# Altium project Main_Matrix_Schematics.PrjPcb
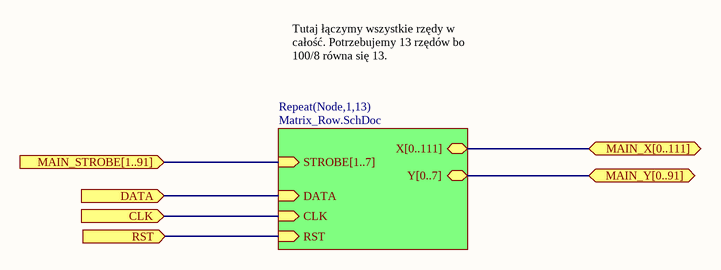
[diagram p0: Main_Schematic.SchDoc]
3 sheets, 273 parts. Net scope: hierarchical (ports join the sheet entries above them; power ports are global).
Sheets:
  Main_Schematic.SchDoc
    Node1 = Matrix_Row.SchDoc
      Node1 = Single_Matrix.SchDoc
      Node2 = Single_Matrix.SchDoc
      Node3 = Single_Matrix.SchDoc
      Node4 = Single_Matrix.SchDoc
      Node5 = Single_Matrix.SchDoc
      Node6 = Single_Matrix.SchDoc
      Node7 = Single_Matrix.SchDoc
    Node2 = Matrix_Row.SchDoc
      Node1 = Single_Matrix.SchDoc
      Node2 = Single_Matrix.SchDoc
      Node3 = Single_Matrix.SchDoc
      Node4 = Single_Matrix.SchDoc
      Node5 = Single_Matrix.SchDoc
      Node6 = Single_Matrix.SchDoc
      Node7 = Single_Matrix.SchDoc
    Node3 = Matrix_Row.SchDoc
      Node1 = Single_Matrix.SchDoc
      Node2 = Single_Matrix.SchDoc
      Node3 = Single_Matrix.SchDoc
      Node4 = Single_Matrix.SchDoc
      Node5 = Single_Matrix.SchDoc
      Node6 = Single_Matrix.SchDoc
      Node7 = Single_Matrix.SchDoc
    Node4 = Matrix_Row.SchDoc
      Node1 = Single_Matrix.SchDoc
      Node2 = Single_Matrix.SchDoc
      Node3 = Single_Matrix.SchDoc
      Node4 = Single_Matrix.SchDoc
      Node5 = Single_Matrix.SchDoc
      Node6 = Single_Matrix.SchDoc
      Node7 = Single_Matrix.SchDoc
    Node5 = Matrix_Row.SchDoc
      Node1 = Single_Matrix.SchDoc
      Node2 = Single_Matrix.SchDoc
      Node3 = Single_Matrix.SchDoc
      Node4 = Single_Matrix.SchDoc
      Node5 = Single_Matrix.SchDoc
      Node6 = Single_Matrix.SchDoc
      Node7 = Single_Matrix.SchDoc
    Node6 = Matrix_Row.SchDoc
      Node1 = Single_Matrix.SchDoc
      Node2 = Single_Matrix.SchDoc
      Node3 = Single_Matrix.SchDoc
      Node4 = Single_Matrix.SchDoc
      Node5 = Single_Matrix.SchDoc
      Node6 = Single_Matrix.SchDoc
      Node7 = Single_Matrix.SchDoc
    Node7 = Matrix_Row.SchDoc
      Node1 = Single_Matrix.SchDoc
      Node2 = Single_Matrix.SchDoc
      Node3 = Single_Matrix.SchDoc
      Node4 = Single_Matrix.SchDoc
      Node5 = Single_Matrix.SchDoc
      Node6 = Single_Matrix.SchDoc
      Node7 = Single_Matrix.SchDoc
    Node8 = Matrix_Row.SchDoc
      Node1 = Single_Matrix.SchDoc
      Node2 = Single_Matrix.SchDoc
      Node3 = Single_Matrix.SchDoc
      Node4 = Single_Matrix.SchDoc
      Node5 = Single_Matrix.SchDoc
      Node6 = Single_Matrix.SchDoc
      Node7 = Single_Matrix.SchDoc
    Node9 = Matrix_Row.SchDoc
      Node1 = Single_Matrix.SchDoc
      Node2 = Single_Matrix.SchDoc
      Node3 = Single_Matrix.SchDoc
      Node4 = Single_Matrix.SchDoc
      Node5 = Single_Matrix.SchDoc
      Node6 = Single_Matrix.SchDoc
      Node7 = Single_Matrix.SchDoc
    Node10 = Matrix_Row.SchDoc
      Node1 = Single_Matrix.SchDoc
      Node2 = Single_Matrix.SchDoc
      Node3 = Single_Matrix.SchDoc
      Node4 = Single_Matrix.SchDoc
      Node5 = Single_Matrix.SchDoc
      Node6 = Single_Matrix.SchDoc
      Node7 = Single_Matrix.SchDoc
    Node11 = Matrix_Row.SchDoc
      Node1 = Single_Matrix.SchDoc
      Node2 = Single_Matrix.SchDoc
      Node3 = Single_Matrix.SchDoc
      Node4 = Single_Matrix.SchDoc
      Node5 = Single_Matrix.SchDoc
      Node6 = Single_Matrix.SchDoc
      Node7 = Single_Matrix.SchDoc
    Node12 = Matrix_Row.SchDoc
      Node1 = Single_Matrix.SchDoc
      Node2 = Single_Matrix.SchDoc
      Node3 = Single_Matrix.SchDoc
      Node4 = Single_Matrix.SchDoc
      Node5 = Single_Matrix.SchDoc
      Node6 = Single_Matrix.SchDoc
      Node7 = Single_Matrix.SchDoc
    Node13 = Matrix_Row.SchDoc
      Node1 = Single_Matrix.SchDoc
      Node2 = Single_Matrix.SchDoc
      Node3 = Single_Matrix.SchDoc
      Node4 = Single_Matrix.SchDoc
      Node5 = Single_Matrix.SchDoc
      Node6 = Single_Matrix.SchDoc
      Node7 = Single_Matrix.SchDoc

## Sheet Main_Schematic.SchDoc
size A4; Date: 1.06.2026; Author: Jan Rutkowski; CompanyName: KN_HARDWIRE; SheetNumber: 1; SheetTotal: 3

### Sub-sheets
Repeat(Node,1,13) = Matrix_Row.SchDoc: CLK (in), DATA (in), RST (in), STROBE[1..7] (in), X[0..111] (bidir), Y[0..7] (bidir)

### Ports
CLK (in), DATA (in), MAIN_STROBE[1..91] (in), MAIN_X[0..111] (bidir), MAIN_Y[0..91] (bidir), RST (in)

### Nets
(unnamed): port DATA, sheet Repeat(Node,1,13)/DATA
(unnamed): port CLK, sheet Repeat(Node,1,13)/CLK
(unnamed): port RST, sheet Repeat(Node,1,13)/RST

### Buses and harness runs
bus port MAIN_STROBE[1..91] = sheet Repeat(Node,1,13)/STROBE[1..7]
bus port MAIN_X[0..111] = sheet Repeat(Node,1,13)/X[0..111]
bus port MAIN_Y[0..91] = sheet Repeat(Node,1,13)/Y[0..7]

### Notes on the sheet
- Tutaj łączymy wszystkie rzędy w całość. Potrzebujemy 13 rzędów bo 100/8 równa się 13.
- Text
- Company Confidential / Not for distribution
- Project name:
- Document Name:
- Free Documents
- Sheet1.SchDoc
- Designer Name:
- Jan Rutkowski
- Date/Time:
- 10.03.26
- Revison:
- 1

## Sheet Matrix_Row.SchDoc
size A4; Author: Jan Rutkowski; CompanyName: AGH; SheetNumber: 2; SheetTotal: 4
Used 13 times, as channels Node1, Node2, Node3, Node4, Node5, Node6, Node7, Node8, Node9, Node10, Node11, Node12, Node13. Parts and nets are listed once, with the designators drawn on the sheet.
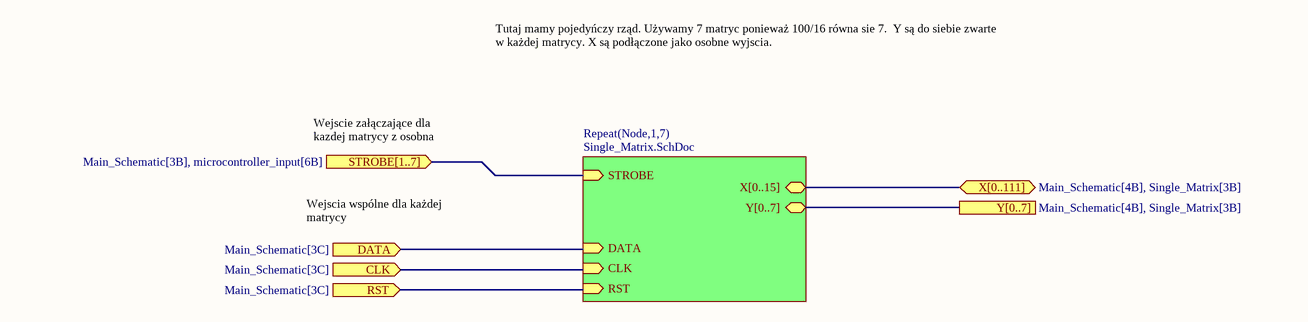
[diagram p1: Matrix_Row.SchDoc]

### Sub-sheets
Repeat(Node,1,7) = Single_Matrix.SchDoc: STROBE (in), DATA (in), CLK (in), RST (in), X[0..15] (bidir), Y[0..7] (bidir)

### Ports
CLK (in, see Main_Schematic[3C]), DATA (in, see Main_Schematic[3C]), RST (in, see Main_Schematic[3C]), STROBE[1..7] (in, see Main_Schematic[3B], microcontroller_input[6B]), X[0..111] (bidir, see Main_Schematic[4B], Single_Matrix[3B]), Y[0..7] (in, see Main_Schematic[4B], Single_Matrix[3B])

### Channels
Node1: ports CLK=open DATA=open RST=open
Node2: ports CLK=open DATA=open RST=open
Node3: ports CLK=open DATA=open RST=open
Node4: ports CLK=open DATA=open RST=open
Node5: ports CLK=open DATA=open RST=open
Node6: ports CLK=open DATA=open RST=open
Node7: ports CLK=open DATA=open RST=open
Node8: ports CLK=open DATA=open RST=open
Node9: ports CLK=open DATA=open RST=open
Node10: ports CLK=open DATA=open RST=open
Node11: ports CLK=open DATA=open RST=open
Node12: ports CLK=open DATA=open RST=open
Node13: ports CLK=open DATA=open RST=open

### Buses and harness runs
bus port X[0..111] = sheet Repeat(Node,1,7)/X[0..15]
bus port Y[0..7] = sheet Repeat(Node,1,7)/Y[0..7]

### Notes on the sheet
- Tutaj mamy pojedyńczy rząd. Używamy 7 matryc ponieważ 100/16 równa sie 7.  Y są do siebie zwarte w każdej matrycy. X są podłączone jako osobne wyjscia.
- Wejscie załączające dla kazdej matrycy z osobna
- Wejscia wspólne dla każdej matrycy
- Text
- Company Confidential / Not for distribution
- Project name:
- Document Name:
- Free Documents
- Sheet1.SchDoc
- Designer Name:
- Jan Rutkowski
- Date/Time:
- 10.03.26
- Revison:
- 1

## Sheet Single_Matrix.SchDoc
size A4; Author: Jan Rutkowski; CompanyName: AGH; SheetNumber: 3; SheetTotal: 4
Used 91 times, as channels Node1/Node1, Node1/Node2, Node1/Node3, Node1/Node4, Node1/Node5, Node1/Node6, Node1/Node7, Node2/Node1, Node2/Node2, Node2/Node3, Node2/Node4, Node2/Node5, Node2/Node6, Node2/Node7, Node3/Node1, Node3/Node2, Node3/Node3, Node3/Node4, Node3/Node5, Node3/Node6, Node3/Node7, Node4/Node1, Node4/Node2, Node4/Node3, Node4/Node4, Node4/Node5, Node4/Node6, Node4/Node7, Node5/Node1, Node5/Node2, Node5/Node3, Node5/Node4, Node5/Node5, Node5/Node6, Node5/Node7, Node6/Node1, Node6/Node2, Node6/Node3, Node6/Node4, Node6/Node5, Node6/Node6, Node6/Node7, Node7/Node1, Node7/Node2, Node7/Node3, Node7/Node4, Node7/Node5, Node7/Node6, Node7/Node7, Node8/Node1, Node8/Node2, Node8/Node3, Node8/Node4, Node8/Node5, Node8/Node6, Node8/Node7, Node9/Node1, Node9/Node2, Node9/Node3, Node9/Node4, Node9/Node5, Node9/Node6, Node9/Node7, Node10/Node1, Node10/Node2, Node10/Node3, Node10/Node4, Node10/Node5, Node10/Node6, Node10/Node7, Node11/Node1, Node11/Node2, Node11/Node3, Node11/Node4, Node11/Node5, Node11/Node6, Node11/Node7, Node12/Node1, Node12/Node2, Node12/Node3, Node12/Node4, Node12/Node5, Node12/Node6, Node12/Node7, Node13/Node1, Node13/Node2, Node13/Node3, Node13/Node4, Node13/Node5, Node13/Node6, Node13/Node7. Parts and nets are listed once, with the designators drawn on the sheet.
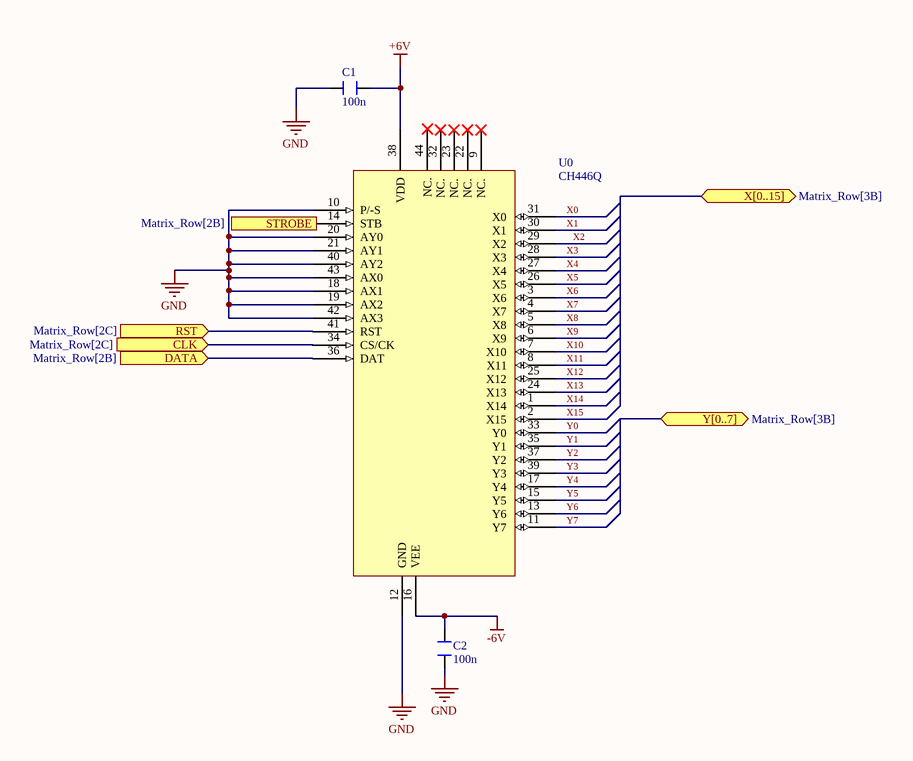
[diagram p2: Single_Matrix.SchDoc]

### Parts
C1  100n  [CL10B104KB8NNNC]
C2  100n  [CL10B104KB8NNNC]
U0  CH446Q  [LQFP-44_CH446Q]

### Ports
CLK (in, see Matrix_Row[2C]), DATA (in, see Matrix_Row[2B]), RST (in, see Matrix_Row[2C]), STROBE (see Matrix_Row[2B]), X[0..15] (bidir, see Matrix_Row[3B]), Y[0..7] (bidir, see Matrix_Row[3B])

### Nets
+6V: C1.8 U0.38(VDD)
-6V: C2.8 U0.16(VEE)
GND: C1.7 C2.7 U0.10(P/-S) U0.12(GND) U0.18(AX1) U0.19(AX2) U0.20(AY0) U0.21(AY1) U0.40(AY2) U0.42(AX3) U0.43(AX0)
CLK: U0.34(CS/CK) ; port CLK
DATA: U0.36(DAT) ; port DATA
RST: U0.41(RST) ; port RST
X0: U0.31(X0)
X1: U0.30(X1)
X2: U0.29(X2)
X3: U0.28(X3)
X4: U0.27(X4)
X5: U0.26(X5)
X6: U0.3(X6)
X7: U0.4(X7)
X8: U0.5(X8)
X9: U0.6(X9)
X10: U0.7(X10)
X11: U0.8(X11)
X12: U0.25(X12)
X13: U0.24(X13)
X14: U0.1(X14)
X15: U0.2(X15)
Y0: U0.33(Y0)
Y1: U0.35(Y1)
Y2: U0.37(Y2)
Y3: U0.39(Y3)
Y4: U0.17(Y4)
Y5: U0.15(Y5)
Y6: U0.13(Y6)
Y7: U0.11(Y7)

Not connected (* = marked no-connect by the designer): U0 9(NC.)* 14(STB) 22(NC.)* 23(NC.)* 32(NC.)* 44(NC.)*

### Channels
Node1/Node1: designators end in _Node1_Node1; ports CLK=NetU0_Node1_Node1_34 DATA=NetU0_Node1_Node1_36 RST=NetU0_Node1_Node1_41 STROBE=open
Node1/Node2: designators end in _Node1_Node2; ports CLK=NetU0_Node1_Node1_34 DATA=NetU0_Node1_Node1_36 RST=NetU0_Node1_Node1_41 STROBE=open
Node1/Node3: designators end in _Node1_Node3; ports CLK=NetU0_Node1_Node1_34 DATA=NetU0_Node1_Node1_36 RST=NetU0_Node1_Node1_41 STROBE=open
Node1/Node4: designators end in _Node1_Node4; ports CLK=NetU0_Node1_Node1_34 DATA=NetU0_Node1_Node1_36 RST=NetU0_Node1_Node1_41 STROBE=open
Node1/Node5: designators end in _Node1_Node5; ports CLK=NetU0_Node1_Node1_34 DATA=NetU0_Node1_Node1_36 RST=NetU0_Node1_Node1_41 STROBE=open
Node1/Node6: designators end in _Node1_Node6; ports CLK=NetU0_Node1_Node1_34 DATA=NetU0_Node1_Node1_36 RST=NetU0_Node1_Node1_41 STROBE=open
Node1/Node7: designators end in _Node1_Node7; ports CLK=NetU0_Node1_Node1_34 DATA=NetU0_Node1_Node1_36 RST=NetU0_Node1_Node1_41 STROBE=open
Node2/Node1: designators end in _Node2_Node1; ports CLK=NetU0_Node2_Node1_34 DATA=NetU0_Node2_Node1_36 RST=NetU0_Node2_Node1_41 STROBE=open
Node2/Node2: designators end in _Node2_Node2; ports CLK=NetU0_Node2_Node1_34 DATA=NetU0_Node2_Node1_36 RST=NetU0_Node2_Node1_41 STROBE=open
Node2/Node3: designators end in _Node2_Node3; ports CLK=NetU0_Node2_Node1_34 DATA=NetU0_Node2_Node1_36 RST=NetU0_Node2_Node1_41 STROBE=open
Node2/Node4: designators end in _Node2_Node4; ports CLK=NetU0_Node2_Node1_34 DATA=NetU0_Node2_Node1_36 RST=NetU0_Node2_Node1_41 STROBE=open
Node2/Node5: designators end in _Node2_Node5; ports CLK=NetU0_Node2_Node1_34 DATA=NetU0_Node2_Node1_36 RST=NetU0_Node2_Node1_41 STROBE=open
Node2/Node6: designators end in _Node2_Node6; ports CLK=NetU0_Node2_Node1_34 DATA=NetU0_Node2_Node1_36 RST=NetU0_Node2_Node1_41 STROBE=open
Node2/Node7: designators end in _Node2_Node7; ports CLK=NetU0_Node2_Node1_34 DATA=NetU0_Node2_Node1_36 RST=NetU0_Node2_Node1_41 STROBE=open
Node3/Node1: designators end in _Node3_Node1; ports CLK=NetU0_Node3_Node1_34 DATA=NetU0_Node3_Node1_36 RST=NetU0_Node3_Node1_41 STROBE=open
Node3/Node2: designators end in _Node3_Node2; ports CLK=NetU0_Node3_Node1_34 DATA=NetU0_Node3_Node1_36 RST=NetU0_Node3_Node1_41 STROBE=open
Node3/Node3: designators end in _Node3_Node3; ports CLK=NetU0_Node3_Node1_34 DATA=NetU0_Node3_Node1_36 RST=NetU0_Node3_Node1_41 STROBE=open
Node3/Node4: designators end in _Node3_Node4; ports CLK=NetU0_Node3_Node1_34 DATA=NetU0_Node3_Node1_36 RST=NetU0_Node3_Node1_41 STROBE=open
Node3/Node5: designators end in _Node3_Node5; ports CLK=NetU0_Node3_Node1_34 DATA=NetU0_Node3_Node1_36 RST=NetU0_Node3_Node1_41 STROBE=open
Node3/Node6: designators end in _Node3_Node6; ports CLK=NetU0_Node3_Node1_34 DATA=NetU0_Node3_Node1_36 RST=NetU0_Node3_Node1_41 STROBE=open
Node3/Node7: designators end in _Node3_Node7; ports CLK=NetU0_Node3_Node1_34 DATA=NetU0_Node3_Node1_36 RST=NetU0_Node3_Node1_41 STROBE=open
Node4/Node1: designators end in _Node4_Node1; ports CLK=NetU0_Node4_Node1_34 DATA=NetU0_Node4_Node1_36 RST=NetU0_Node4_Node1_41 STROBE=open
Node4/Node2: designators end in _Node4_Node2; ports CLK=NetU0_Node4_Node1_34 DATA=NetU0_Node4_Node1_36 RST=NetU0_Node4_Node1_41 STROBE=open
Node4/Node3: designators end in _Node4_Node3; ports CLK=NetU0_Node4_Node1_34 DATA=NetU0_Node4_Node1_36 RST=NetU0_Node4_Node1_41 STROBE=open
Node4/Node4: designators end in _Node4_Node4; ports CLK=NetU0_Node4_Node1_34 DATA=NetU0_Node4_Node1_36 RST=NetU0_Node4_Node1_41 STROBE=open
Node4/Node5: designators end in _Node4_Node5; ports CLK=NetU0_Node4_Node1_34 DATA=NetU0_Node4_Node1_36 RST=NetU0_Node4_Node1_41 STROBE=open
Node4/Node6: designators end in _Node4_Node6; ports CLK=NetU0_Node4_Node1_34 DATA=NetU0_Node4_Node1_36 RST=NetU0_Node4_Node1_41 STROBE=open
Node4/Node7: designators end in _Node4_Node7; ports CLK=NetU0_Node4_Node1_34 DATA=NetU0_Node4_Node1_36 RST=NetU0_Node4_Node1_41 STROBE=open
Node5/Node1: designators end in _Node5_Node1; ports CLK=NetU0_Node5_Node1_34 DATA=NetU0_Node5_Node1_36 RST=NetU0_Node5_Node1_41 STROBE=open
Node5/Node2: designators end in _Node5_Node2; ports CLK=NetU0_Node5_Node1_34 DATA=NetU0_Node5_Node1_36 RST=NetU0_Node5_Node1_41 STROBE=open
Node5/Node3: designators end in _Node5_Node3; ports CLK=NetU0_Node5_Node1_34 DATA=NetU0_Node5_Node1_36 RST=NetU0_Node5_Node1_41 STROBE=open
Node5/Node4: designators end in _Node5_Node4; ports CLK=NetU0_Node5_Node1_34 DATA=NetU0_Node5_Node1_36 RST=NetU0_Node5_Node1_41 STROBE=open
Node5/Node5: designators end in _Node5_Node5; ports CLK=NetU0_Node5_Node1_34 DATA=NetU0_Node5_Node1_36 RST=NetU0_Node5_Node1_41 STROBE=open
Node5/Node6: designators end in _Node5_Node6; ports CLK=NetU0_Node5_Node1_34 DATA=NetU0_Node5_Node1_36 RST=NetU0_Node5_Node1_41 STROBE=open
Node5/Node7: designators end in _Node5_Node7; ports CLK=NetU0_Node5_Node1_34 DATA=NetU0_Node5_Node1_36 RST=NetU0_Node5_Node1_41 STROBE=open
Node6/Node1: designators end in _Node6_Node1; ports CLK=NetU0_Node6_Node1_34 DATA=NetU0_Node6_Node1_36 RST=NetU0_Node6_Node1_41 STROBE=open
Node6/Node2: designators end in _Node6_Node2; ports CLK=NetU0_Node6_Node1_34 DATA=NetU0_Node6_Node1_36 RST=NetU0_Node6_Node1_41 STROBE=open
Node6/Node3: designators end in _Node6_Node3; ports CLK=NetU0_Node6_Node1_34 DATA=NetU0_Node6_Node1_36 RST=NetU0_Node6_Node1_41 STROBE=open
Node6/Node4: designators end in _Node6_Node4; ports CLK=NetU0_Node6_Node1_34 DATA=NetU0_Node6_Node1_36 RST=NetU0_Node6_Node1_41 STROBE=open
Node6/Node5: designators end in _Node6_Node5; ports CLK=NetU0_Node6_Node1_34 DATA=NetU0_Node6_Node1_36 RST=NetU0_Node6_Node1_41 STROBE=open
Node6/Node6: designators end in _Node6_Node6; ports CLK=NetU0_Node6_Node1_34 DATA=NetU0_Node6_Node1_36 RST=NetU0_Node6_Node1_41 STROBE=open
Node6/Node7: designators end in _Node6_Node7; ports CLK=NetU0_Node6_Node1_34 DATA=NetU0_Node6_Node1_36 RST=NetU0_Node6_Node1_41 STROBE=open
Node7/Node1: designators end in _Node7_Node1; ports CLK=NetU0_Node7_Node1_34 DATA=NetU0_Node7_Node1_36 RST=NetU0_Node7_Node1_41 STROBE=open
Node7/Node2: designators end in _Node7_Node2; ports CLK=NetU0_Node7_Node1_34 DATA=NetU0_Node7_Node1_36 RST=NetU0_Node7_Node1_41 STROBE=open
Node7/Node3: designators end in _Node7_Node3; ports CLK=NetU0_Node7_Node1_34 DATA=NetU0_Node7_Node1_36 RST=NetU0_Node7_Node1_41 STROBE=open
Node7/Node4: designators end in _Node7_Node4; ports CLK=NetU0_Node7_Node1_34 DATA=NetU0_Node7_Node1_36 RST=NetU0_Node7_Node1_41 STROBE=open
Node7/Node5: designators end in _Node7_Node5; ports CLK=NetU0_Node7_Node1_34 DATA=NetU0_Node7_Node1_36 RST=NetU0_Node7_Node1_41 STROBE=open
Node7/Node6: designators end in _Node7_Node6; ports CLK=NetU0_Node7_Node1_34 DATA=NetU0_Node7_Node1_36 RST=NetU0_Node7_Node1_41 STROBE=open
Node7/Node7: designators end in _Node7_Node7; ports CLK=NetU0_Node7_Node1_34 DATA=NetU0_Node7_Node1_36 RST=NetU0_Node7_Node1_41 STROBE=open
Node8/Node1: designators end in _Node8_Node1; ports CLK=NetU0_Node8_Node1_34 DATA=NetU0_Node8_Node1_36 RST=NetU0_Node8_Node1_41 STROBE=open
Node8/Node2: designators end in _Node8_Node2; ports CLK=NetU0_Node8_Node1_34 DATA=NetU0_Node8_Node1_36 RST=NetU0_Node8_Node1_41 STROBE=open
Node8/Node3: designators end in _Node8_Node3; ports CLK=NetU0_Node8_Node1_34 DATA=NetU0_Node8_Node1_36 RST=NetU0_Node8_Node1_41 STROBE=open
Node8/Node4: designators end in _Node8_Node4; ports CLK=NetU0_Node8_Node1_34 DATA=NetU0_Node8_Node1_36 RST=NetU0_Node8_Node1_41 STROBE=open
Node8/Node5: designators end in _Node8_Node5; ports CLK=NetU0_Node8_Node1_34 DATA=NetU0_Node8_Node1_36 RST=NetU0_Node8_Node1_41 STROBE=open
Node8/Node6: designators end in _Node8_Node6; ports CLK=NetU0_Node8_Node1_34 DATA=NetU0_Node8_Node1_36 RST=NetU0_Node8_Node1_41 STROBE=open
Node8/Node7: designators end in _Node8_Node7; ports CLK=NetU0_Node8_Node1_34 DATA=NetU0_Node8_Node1_36 RST=NetU0_Node8_Node1_41 STROBE=open
Node9/Node1: designators end in _Node9_Node1; ports CLK=NetU0_Node9_Node1_34 DATA=NetU0_Node9_Node1_36 RST=NetU0_Node9_Node1_41 STROBE=open
Node9/Node2: designators end in _Node9_Node2; ports CLK=NetU0_Node9_Node1_34 DATA=NetU0_Node9_Node1_36 RST=NetU0_Node9_Node1_41 STROBE=open
Node9/Node3: designators end in _Node9_Node3; ports CLK=NetU0_Node9_Node1_34 DATA=NetU0_Node9_Node1_36 RST=NetU0_Node9_Node1_41 STROBE=open
Node9/Node4: designators end in _Node9_Node4; ports CLK=NetU0_Node9_Node1_34 DATA=NetU0_Node9_Node1_36 RST=NetU0_Node9_Node1_41 STROBE=open
Node9/Node5: designators end in _Node9_Node5; ports CLK=NetU0_Node9_Node1_34 DATA=NetU0_Node9_Node1_36 RST=NetU0_Node9_Node1_41 STROBE=open
Node9/Node6: designators end in _Node9_Node6; ports CLK=NetU0_Node9_Node1_34 DATA=NetU0_Node9_Node1_36 RST=NetU0_Node9_Node1_41 STROBE=open
Node9/Node7: designators end in _Node9_Node7; ports CLK=NetU0_Node9_Node1_34 DATA=NetU0_Node9_Node1_36 RST=NetU0_Node9_Node1_41 STROBE=open
Node10/Node1: designators end in _Node10_Node1; ports CLK=NetU0_Node10_Node1_34 DATA=NetU0_Node10_Node1_36 RST=NetU0_Node10_Node1_41 STROBE=open
Node10/Node2: designators end in _Node10_Node2; ports CLK=NetU0_Node10_Node1_34 DATA=NetU0_Node10_Node1_36 RST=NetU0_Node10_Node1_41 STROBE=open
Node10/Node3: designators end in _Node10_Node3; ports CLK=NetU0_Node10_Node1_34 DATA=NetU0_Node10_Node1_36 RST=NetU0_Node10_Node1_41 STROBE=open
Node10/Node4: designators end in _Node10_Node4; ports CLK=NetU0_Node10_Node1_34 DATA=NetU0_Node10_Node1_36 RST=NetU0_Node10_Node1_41 STROBE=open
Node10/Node5: designators end in _Node10_Node5; ports CLK=NetU0_Node10_Node1_34 DATA=NetU0_Node10_Node1_36 RST=NetU0_Node10_Node1_41 STROBE=open
Node10/Node6: designators end in _Node10_Node6; ports CLK=NetU0_Node10_Node1_34 DATA=NetU0_Node10_Node1_36 RST=NetU0_Node10_Node1_41 STROBE=open
Node10/Node7: designators end in _Node10_Node7; ports CLK=NetU0_Node10_Node1_34 DATA=NetU0_Node10_Node1_36 RST=NetU0_Node10_Node1_41 STROBE=open
Node11/Node1: designators end in _Node11_Node1; ports CLK=NetU0_Node11_Node1_34 DATA=NetU0_Node11_Node1_36 RST=NetU0_Node11_Node1_41 STROBE=open
Node11/Node2: designators end in _Node11_Node2; ports CLK=NetU0_Node11_Node1_34 DATA=NetU0_Node11_Node1_36 RST=NetU0_Node11_Node1_41 STROBE=open
Node11/Node3: designators end in _Node11_Node3; ports CLK=NetU0_Node11_Node1_34 DATA=NetU0_Node11_Node1_36 RST=NetU0_Node11_Node1_41 STROBE=open
Node11/Node4: designators end in _Node11_Node4; ports CLK=NetU0_Node11_Node1_34 DATA=NetU0_Node11_Node1_36 RST=NetU0_Node11_Node1_41 STROBE=open
Node11/Node5: designators end in _Node11_Node5; ports CLK=NetU0_Node11_Node1_34 DATA=NetU0_Node11_Node1_36 RST=NetU0_Node11_Node1_41 STROBE=open
Node11/Node6: designators end in _Node11_Node6; ports CLK=NetU0_Node11_Node1_34 DATA=NetU0_Node11_Node1_36 RST=NetU0_Node11_Node1_41 STROBE=open
Node11/Node7: designators end in _Node11_Node7; ports CLK=NetU0_Node11_Node1_34 DATA=NetU0_Node11_Node1_36 RST=NetU0_Node11_Node1_41 STROBE=open
Node12/Node1: designators end in _Node12_Node1; ports CLK=NetU0_Node12_Node1_34 DATA=NetU0_Node12_Node1_36 RST=NetU0_Node12_Node1_41 STROBE=open
Node12/Node2: designators end in _Node12_Node2; ports CLK=NetU0_Node12_Node1_34 DATA=NetU0_Node12_Node1_36 RST=NetU0_Node12_Node1_41 STROBE=open
Node12/Node3: designators end in _Node12_Node3; ports CLK=NetU0_Node12_Node1_34 DATA=NetU0_Node12_Node1_36 RST=NetU0_Node12_Node1_41 STROBE=open
Node12/Node4: designators end in _Node12_Node4; ports CLK=NetU0_Node12_Node1_34 DATA=NetU0_Node12_Node1_36 RST=NetU0_Node12_Node1_41 STROBE=open
Node12/Node5: designators end in _Node12_Node5; ports CLK=NetU0_Node12_Node1_34 DATA=NetU0_Node12_Node1_36 RST=NetU0_Node12_Node1_41 STROBE=open
Node12/Node6: designators end in _Node12_Node6; ports CLK=NetU0_Node12_Node1_34 DATA=NetU0_Node12_Node1_36 RST=NetU0_Node12_Node1_41 STROBE=open
Node12/Node7: designators end in _Node12_Node7; ports CLK=NetU0_Node12_Node1_34 DATA=NetU0_Node12_Node1_36 RST=NetU0_Node12_Node1_41 STROBE=open
Node13/Node1: designators end in _Node13_Node1; ports CLK=NetU0_Node13_Node1_34 DATA=NetU0_Node13_Node1_36 RST=NetU0_Node13_Node1_41 STROBE=open
Node13/Node2: designators end in _Node13_Node2; ports CLK=NetU0_Node13_Node1_34 DATA=NetU0_Node13_Node1_36 RST=NetU0_Node13_Node1_41 STROBE=open
Node13/Node3: designators end in _Node13_Node3; ports CLK=NetU0_Node13_Node1_34 DATA=NetU0_Node13_Node1_36 RST=NetU0_Node13_Node1_41 STROBE=open
Node13/Node4: designators end in _Node13_Node4; ports CLK=NetU0_Node13_Node1_34 DATA=NetU0_Node13_Node1_36 RST=NetU0_Node13_Node1_41 STROBE=open
Node13/Node5: designators end in _Node13_Node5; ports CLK=NetU0_Node13_Node1_34 DATA=NetU0_Node13_Node1_36 RST=NetU0_Node13_Node1_41 STROBE=open
Node13/Node6: designators end in _Node13_Node6; ports CLK=NetU0_Node13_Node1_34 DATA=NetU0_Node13_Node1_36 RST=NetU0_Node13_Node1_41 STROBE=open
Node13/Node7: designators end in _Node13_Node7; ports CLK=NetU0_Node13_Node1_34 DATA=NetU0_Node13_Node1_36 RST=NetU0_Node13_Node1_41 STROBE=open

### Notes on the sheet
- Text
- Company Confidential / Not for distribution
- Project name:
- Document Name:
- Free Documents
- Sheet1.SchDoc
- Designer Name:
- Jan Rutkowski
- Date/Time:
- 10.03.26
- Revison:
- 1

### Library data of the parts
C1 C2 = CL10B104KB8NNNC: Capacitor SMD 0603 100n to VDD, VBAT, VDDA, VREF+, VDDUSB, NRST; ComponentLink1Description: New link; ComponentLink1URL: *; Supplier 1: RS; Supplier Part Number 1: 7665443
U0 = CH446Q: Analog Switch Array

## Nets that join several sheets
+6V: Node1/Node1 (C1_Node1_Node1.8 U0_Node1_Node1.38), Node1/Node2 (C1_Node1_Node2.8 U0_Node1_Node2.38), Node1/Node3 (C1_Node1_Node3.8 U0_Node1_Node3.38), Node1/Node4 (C1_Node1_Node4.8 U0_Node1_Node4.38), Node1/Node5 (C1_Node1_Node5.8 U0_Node1_Node5.38), Node1/Node6 (C1_Node1_Node6.8 U0_Node1_Node6.38), Node1/Node7 (C1_Node1_Node7.8 U0_Node1_Node7.38), Node2/Node1 (C1_Node2_Node1.8 U0_Node2_Node1.38), Node2/Node2 (C1_Node2_Node2.8 U0_Node2_Node2.38), Node2/Node3 (C1_Node2_Node3.8 U0_Node2_Node3.38), Node2/Node4 (C1_Node2_Node4.8 U0_Node2_Node4.38), Node2/Node5 (C1_Node2_Node5.8 U0_Node2_Node5.38), Node2/Node6 (C1_Node2_Node6.8 U0_Node2_Node6.38), Node2/Node7 (C1_Node2_Node7.8 U0_Node2_Node7.38), Node3/Node1 (C1_Node3_Node1.8 U0_Node3_Node1.38), Node3/Node2 (C1_Node3_Node2.8 U0_Node3_Node2.38), Node3/Node3 (C1_Node3_Node3.8 U0_Node3_Node3.38), Node3/Node4 (C1_Node3_Node4.8 U0_Node3_Node4.38), Node3/Node5 (C1_Node3_Node5.8 U0_Node3_Node5.38), Node3/Node6 (C1_Node3_Node6.8 U0_Node3_Node6.38), Node3/Node7 (C1_Node3_Node7.8 U0_Node3_Node7.38), Node4/Node1 (C1_Node4_Node1.8 U0_Node4_Node1.38), Node4/Node2 (C1_Node4_Node2.8 U0_Node4_Node2.38), Node4/Node3 (C1_Node4_Node3.8 U0_Node4_Node3.38), Node4/Node4 (C1_Node4_Node4.8 U0_Node4_Node4.38), Node4/Node5 (C1_Node4_Node5.8 U0_Node4_Node5.38), Node4/Node6 (C1_Node4_Node6.8 U0_Node4_Node6.38), Node4/Node7 (C1_Node4_Node7.8 U0_Node4_Node7.38), Node5/Node1 (C1_Node5_Node1.8 U0_Node5_Node1.38), Node5/Node2 (C1_Node5_Node2.8 U0_Node5_Node2.38), Node5/Node3 (C1_Node5_Node3.8 U0_Node5_Node3.38), Node5/Node4 (C1_Node5_Node4.8 U0_Node5_Node4.38), Node5/Node5 (C1_Node5_Node5.8 U0_Node5_Node5.38), Node5/Node6 (C1_Node5_Node6.8 U0_Node5_Node6.38), Node5/Node7 (C1_Node5_Node7.8 U0_Node5_Node7.38), Node6/Node1 (C1_Node6_Node1.8 U0_Node6_Node1.38), Node6/Node2 (C1_Node6_Node2.8 U0_Node6_Node2.38), Node6/Node3 (C1_Node6_Node3.8 U0_Node6_Node3.38), Node6/Node4 (C1_Node6_Node4.8 U0_Node6_Node4.38), Node6/Node5 (C1_Node6_Node5.8 U0_Node6_Node5.38), Node6/Node6 (C1_Node6_Node6.8 U0_Node6_Node6.38), Node6/Node7 (C1_Node6_Node7.8 U0_Node6_Node7.38), Node7/Node1 (C1_Node7_Node1.8 U0_Node7_Node1.38), Node7/Node2 (C1_Node7_Node2.8 U0_Node7_Node2.38), Node7/Node3 (C1_Node7_Node3.8 U0_Node7_Node3.38), Node7/Node4 (C1_Node7_Node4.8 U0_Node7_Node4.38), Node7/Node5 (C1_Node7_Node5.8 U0_Node7_Node5.38), Node7/Node6 (C1_Node7_Node6.8 U0_Node7_Node6.38), Node7/Node7 (C1_Node7_Node7.8 U0_Node7_Node7.38), Node8/Node1 (C1_Node8_Node1.8 U0_Node8_Node1.38), Node8/Node2 (C1_Node8_Node2.8 U0_Node8_Node2.38), Node8/Node3 (C1_Node8_Node3.8 U0_Node8_Node3.38), Node8/Node4 (C1_Node8_Node4.8 U0_Node8_Node4.38), Node8/Node5 (C1_Node8_Node5.8 U0_Node8_Node5.38), Node8/Node6 (C1_Node8_Node6.8 U0_Node8_Node6.38), Node8/Node7 (C1_Node8_Node7.8 U0_Node8_Node7.38), Node9/Node1 (C1_Node9_Node1.8 U0_Node9_Node1.38), Node9/Node2 (C1_Node9_Node2.8 U0_Node9_Node2.38), Node9/Node3 (C1_Node9_Node3.8 U0_Node9_Node3.38), Node9/Node4 (C1_Node9_Node4.8 U0_Node9_Node4.38), Node9/Node5 (C1_Node9_Node5.8 U0_Node9_Node5.38), Node9/Node6 (C1_Node9_Node6.8 U0_Node9_Node6.38), Node9/Node7 (C1_Node9_Node7.8 U0_Node9_Node7.38), Node10/Node1 (C1_Node10_Node1.8 U0_Node10_Node1.38), Node10/Node2 (C1_Node10_Node2.8 U0_Node10_Node2.38), Node10/Node3 (C1_Node10_Node3.8 U0_Node10_Node3.38), Node10/Node4 (C1_Node10_Node4.8 U0_Node10_Node4.38), Node10/Node5 (C1_Node10_Node5.8 U0_Node10_Node5.38), Node10/Node6 (C1_Node10_Node6.8 U0_Node10_Node6.38), Node10/Node7 (C1_Node10_Node7.8 U0_Node10_Node7.38), Node11/Node1 (C1_Node11_Node1.8 U0_Node11_Node1.38), Node11/Node2 (C1_Node11_Node2.8 U0_Node11_Node2.38), Node11/Node3 (C1_Node11_Node3.8 U0_Node11_Node3.38), Node11/Node4 (C1_Node11_Node4.8 U0_Node11_Node4.38), Node11/Node5 (C1_Node11_Node5.8 U0_Node11_Node5.38), Node11/Node6 (C1_Node11_Node6.8 U0_Node11_Node6.38), Node11/Node7 (C1_Node11_Node7.8 U0_Node11_Node7.38), Node12/Node1 (C1_Node12_Node1.8 U0_Node12_Node1.38), Node12/Node2 (C1_Node12_Node2.8 U0_Node12_Node2.38), Node12/Node3 (C1_Node12_Node3.8 U0_Node12_Node3.38), Node12/Node4 (C1_Node12_Node4.8 U0_Node12_Node4.38), Node12/Node5 (C1_Node12_Node5.8 U0_Node12_Node5.38), Node12/Node6 (C1_Node12_Node6.8 U0_Node12_Node6.38), Node12/Node7 (C1_Node12_Node7.8 U0_Node12_Node7.38), Node13/Node1 (C1_Node13_Node1.8 U0_Node13_Node1.38), Node13/Node2 (C1_Node13_Node2.8 U0_Node13_Node2.38), Node13/Node3 (C1_Node13_Node3.8 U0_Node13_Node3.38), Node13/Node4 (C1_Node13_Node4.8 U0_Node13_Node4.38), Node13/Node5 (C1_Node13_Node5.8 U0_Node13_Node5.38), Node13/Node6 (C1_Node13_Node6.8 U0_Node13_Node6.38), Node13/Node7 (C1_Node13_Node7.8 U0_Node13_Node7.38)
-6V: Node1/Node1 (C2_Node1_Node1.8 U0_Node1_Node1.16), Node1/Node2 (C2_Node1_Node2.8 U0_Node1_Node2.16), Node1/Node3 (C2_Node1_Node3.8 U0_Node1_Node3.16), Node1/Node4 (C2_Node1_Node4.8 U0_Node1_Node4.16), Node1/Node5 (C2_Node1_Node5.8 U0_Node1_Node5.16), Node1/Node6 (C2_Node1_Node6.8 U0_Node1_Node6.16), Node1/Node7 (C2_Node1_Node7.8 U0_Node1_Node7.16), Node2/Node1 (C2_Node2_Node1.8 U0_Node2_Node1.16), Node2/Node2 (C2_Node2_Node2.8 U0_Node2_Node2.16), Node2/Node3 (C2_Node2_Node3.8 U0_Node2_Node3.16), Node2/Node4 (C2_Node2_Node4.8 U0_Node2_Node4.16), Node2/Node5 (C2_Node2_Node5.8 U0_Node2_Node5.16), Node2/Node6 (C2_Node2_Node6.8 U0_Node2_Node6.16), Node2/Node7 (C2_Node2_Node7.8 U0_Node2_Node7.16), Node3/Node1 (C2_Node3_Node1.8 U0_Node3_Node1.16), Node3/Node2 (C2_Node3_Node2.8 U0_Node3_Node2.16), Node3/Node3 (C2_Node3_Node3.8 U0_Node3_Node3.16), Node3/Node4 (C2_Node3_Node4.8 U0_Node3_Node4.16), Node3/Node5 (C2_Node3_Node5.8 U0_Node3_Node5.16), Node3/Node6 (C2_Node3_Node6.8 U0_Node3_Node6.16), Node3/Node7 (C2_Node3_Node7.8 U0_Node3_Node7.16), Node4/Node1 (C2_Node4_Node1.8 U0_Node4_Node1.16), Node4/Node2 (C2_Node4_Node2.8 U0_Node4_Node2.16), Node4/Node3 (C2_Node4_Node3.8 U0_Node4_Node3.16), Node4/Node4 (C2_Node4_Node4.8 U0_Node4_Node4.16), Node4/Node5 (C2_Node4_Node5.8 U0_Node4_Node5.16), Node4/Node6 (C2_Node4_Node6.8 U0_Node4_Node6.16), Node4/Node7 (C2_Node4_Node7.8 U0_Node4_Node7.16), Node5/Node1 (C2_Node5_Node1.8 U0_Node5_Node1.16), Node5/Node2 (C2_Node5_Node2.8 U0_Node5_Node2.16), Node5/Node3 (C2_Node5_Node3.8 U0_Node5_Node3.16), Node5/Node4 (C2_Node5_Node4.8 U0_Node5_Node4.16), Node5/Node5 (C2_Node5_Node5.8 U0_Node5_Node5.16), Node5/Node6 (C2_Node5_Node6.8 U0_Node5_Node6.16), Node5/Node7 (C2_Node5_Node7.8 U0_Node5_Node7.16), Node6/Node1 (C2_Node6_Node1.8 U0_Node6_Node1.16), Node6/Node2 (C2_Node6_Node2.8 U0_Node6_Node2.16), Node6/Node3 (C2_Node6_Node3.8 U0_Node6_Node3.16), Node6/Node4 (C2_Node6_Node4.8 U0_Node6_Node4.16), Node6/Node5 (C2_Node6_Node5.8 U0_Node6_Node5.16), Node6/Node6 (C2_Node6_Node6.8 U0_Node6_Node6.16), Node6/Node7 (C2_Node6_Node7.8 U0_Node6_Node7.16), Node7/Node1 (C2_Node7_Node1.8 U0_Node7_Node1.16), Node7/Node2 (C2_Node7_Node2.8 U0_Node7_Node2.16), Node7/Node3 (C2_Node7_Node3.8 U0_Node7_Node3.16), Node7/Node4 (C2_Node7_Node4.8 U0_Node7_Node4.16), Node7/Node5 (C2_Node7_Node5.8 U0_Node7_Node5.16), Node7/Node6 (C2_Node7_Node6.8 U0_Node7_Node6.16), Node7/Node7 (C2_Node7_Node7.8 U0_Node7_Node7.16), Node8/Node1 (C2_Node8_Node1.8 U0_Node8_Node1.16), Node8/Node2 (C2_Node8_Node2.8 U0_Node8_Node2.16), Node8/Node3 (C2_Node8_Node3.8 U0_Node8_Node3.16), Node8/Node4 (C2_Node8_Node4.8 U0_Node8_Node4.16), Node8/Node5 (C2_Node8_Node5.8 U0_Node8_Node5.16), Node8/Node6 (C2_Node8_Node6.8 U0_Node8_Node6.16), Node8/Node7 (C2_Node8_Node7.8 U0_Node8_Node7.16), Node9/Node1 (C2_Node9_Node1.8 U0_Node9_Node1.16), Node9/Node2 (C2_Node9_Node2.8 U0_Node9_Node2.16), Node9/Node3 (C2_Node9_Node3.8 U0_Node9_Node3.16), Node9/Node4 (C2_Node9_Node4.8 U0_Node9_Node4.16), Node9/Node5 (C2_Node9_Node5.8 U0_Node9_Node5.16), Node9/Node6 (C2_Node9_Node6.8 U0_Node9_Node6.16), Node9/Node7 (C2_Node9_Node7.8 U0_Node9_Node7.16), Node10/Node1 (C2_Node10_Node1.8 U0_Node10_Node1.16), Node10/Node2 (C2_Node10_Node2.8 U0_Node10_Node2.16), Node10/Node3 (C2_Node10_Node3.8 U0_Node10_Node3.16), Node10/Node4 (C2_Node10_Node4.8 U0_Node10_Node4.16), Node10/Node5 (C2_Node10_Node5.8 U0_Node10_Node5.16), Node10/Node6 (C2_Node10_Node6.8 U0_Node10_Node6.16), Node10/Node7 (C2_Node10_Node7.8 U0_Node10_Node7.16), Node11/Node1 (C2_Node11_Node1.8 U0_Node11_Node1.16), Node11/Node2 (C2_Node11_Node2.8 U0_Node11_Node2.16), Node11/Node3 (C2_Node11_Node3.8 U0_Node11_Node3.16), Node11/Node4 (C2_Node11_Node4.8 U0_Node11_Node4.16), Node11/Node5 (C2_Node11_Node5.8 U0_Node11_Node5.16), Node11/Node6 (C2_Node11_Node6.8 U0_Node11_Node6.16), Node11/Node7 (C2_Node11_Node7.8 U0_Node11_Node7.16), Node12/Node1 (C2_Node12_Node1.8 U0_Node12_Node1.16), Node12/Node2 (C2_Node12_Node2.8 U0_Node12_Node2.16), Node12/Node3 (C2_Node12_Node3.8 U0_Node12_Node3.16), Node12/Node4 (C2_Node12_Node4.8 U0_Node12_Node4.16), Node12/Node5 (C2_Node12_Node5.8 U0_Node12_Node5.16), Node12/Node6 (C2_Node12_Node6.8 U0_Node12_Node6.16), Node12/Node7 (C2_Node12_Node7.8 U0_Node12_Node7.16), Node13/Node1 (C2_Node13_Node1.8 U0_Node13_Node1.16), Node13/Node2 (C2_Node13_Node2.8 U0_Node13_Node2.16), Node13/Node3 (C2_Node13_Node3.8 U0_Node13_Node3.16), Node13/Node4 (C2_Node13_Node4.8 U0_Node13_Node4.16), Node13/Node5 (C2_Node13_Node5.8 U0_Node13_Node5.16), Node13/Node6 (C2_Node13_Node6.8 U0_Node13_Node6.16), Node13/Node7 (C2_Node13_Node7.8 U0_Node13_Node7.16)
GND: Node1/Node1 (11 pins), Node1/Node2 (11 pins), Node1/Node3 (11 pins), Node1/Node4 (11 pins), Node1/Node5 (11 pins), Node1/Node6 (11 pins), Node1/Node7 (11 pins), Node2/Node1 (11 pins), Node2/Node2 (11 pins), Node2/Node3 (11 pins), Node2/Node4 (11 pins), Node2/Node5 (11 pins), Node2/Node6 (11 pins), Node2/Node7 (11 pins), Node3/Node1 (11 pins), Node3/Node2 (11 pins), Node3/Node3 (11 pins), Node3/Node4 (11 pins), Node3/Node5 (11 pins), Node3/Node6 (11 pins), Node3/Node7 (11 pins), Node4/Node1 (11 pins), Node4/Node2 (11 pins), Node4/Node3 (11 pins), Node4/Node4 (11 pins), Node4/Node5 (11 pins), Node4/Node6 (11 pins), Node4/Node7 (11 pins), Node5/Node1 (11 pins), Node5/Node2 (11 pins), Node5/Node3 (11 pins), Node5/Node4 (11 pins), Node5/Node5 (11 pins), Node5/Node6 (11 pins), Node5/Node7 (11 pins), Node6/Node1 (11 pins), Node6/Node2 (11 pins), Node6/Node3 (11 pins), Node6/Node4 (11 pins), Node6/Node5 (11 pins), Node6/Node6 (11 pins), Node6/Node7 (11 pins), Node7/Node1 (11 pins), Node7/Node2 (11 pins), Node7/Node3 (11 pins), Node7/Node4 (11 pins), Node7/Node5 (11 pins), Node7/Node6 (11 pins), Node7/Node7 (11 pins), Node8/Node1 (11 pins), Node8/Node2 (11 pins), Node8/Node3 (11 pins), Node8/Node4 (11 pins), Node8/Node5 (11 pins), Node8/Node6 (11 pins), Node8/Node7 (11 pins), Node9/Node1 (11 pins), Node9/Node2 (11 pins), Node9/Node3 (11 pins), Node9/Node4 (11 pins), Node9/Node5 (11 pins), Node9/Node6 (11 pins), Node9/Node7 (11 pins), Node10/Node1 (11 pins), Node10/Node2 (11 pins), Node10/Node3 (11 pins), Node10/Node4 (11 pins), Node10/Node5 (11 pins), Node10/Node6 (11 pins), Node10/Node7 (11 pins), Node11/Node1 (11 pins), Node11/Node2 (11 pins), Node11/Node3 (11 pins), Node11/Node4 (11 pins), Node11/Node5 (11 pins), Node11/Node6 (11 pins), Node11/Node7 (11 pins), Node12/Node1 (11 pins), Node12/Node2 (11 pins), Node12/Node3 (11 pins), Node12/Node4 (11 pins), Node12/Node5 (11 pins), Node12/Node6 (11 pins), Node12/Node7 (11 pins), Node13/Node1 (11 pins), Node13/Node2 (11 pins), Node13/Node3 (11 pins), Node13/Node4 (11 pins), Node13/Node5 (11 pins), Node13/Node6 (11 pins), Node13/Node7 (11 pins)
NetU0_Node1_Node1_34: Node1/Node1 (U0_Node1_Node1.34), Node1/Node2 (U0_Node1_Node2.34), Node1/Node3 (U0_Node1_Node3.34), Node1/Node4 (U0_Node1_Node4.34), Node1/Node5 (U0_Node1_Node5.34), Node1/Node6 (U0_Node1_Node6.34), Node1/Node7 (U0_Node1_Node7.34)
NetU0_Node1_Node1_36: Node1/Node1 (U0_Node1_Node1.36), Node1/Node2 (U0_Node1_Node2.36), Node1/Node3 (U0_Node1_Node3.36), Node1/Node4 (U0_Node1_Node4.36), Node1/Node5 (U0_Node1_Node5.36), Node1/Node6 (U0_Node1_Node6.36), Node1/Node7 (U0_Node1_Node7.36)
NetU0_Node1_Node1_41: Node1/Node1 (U0_Node1_Node1.41), Node1/Node2 (U0_Node1_Node2.41), Node1/Node3 (U0_Node1_Node3.41), Node1/Node4 (U0_Node1_Node4.41), Node1/Node5 (U0_Node1_Node5.41), Node1/Node6 (U0_Node1_Node6.41), Node1/Node7 (U0_Node1_Node7.41)
NetU0_Node2_Node1_34: Node2/Node1 (U0_Node2_Node1.34), Node2/Node2 (U0_Node2_Node2.34), Node2/Node3 (U0_Node2_Node3.34), Node2/Node4 (U0_Node2_Node4.34), Node2/Node5 (U0_Node2_Node5.34), Node2/Node6 (U0_Node2_Node6.34), Node2/Node7 (U0_Node2_Node7.34)
NetU0_Node2_Node1_36: Node2/Node1 (U0_Node2_Node1.36), Node2/Node2 (U0_Node2_Node2.36), Node2/Node3 (U0_Node2_Node3.36), Node2/Node4 (U0_Node2_Node4.36), Node2/Node5 (U0_Node2_Node5.36), Node2/Node6 (U0_Node2_Node6.36), Node2/Node7 (U0_Node2_Node7.36)
NetU0_Node2_Node1_41: Node2/Node1 (U0_Node2_Node1.41), Node2/Node2 (U0_Node2_Node2.41), Node2/Node3 (U0_Node2_Node3.41), Node2/Node4 (U0_Node2_Node4.41), Node2/Node5 (U0_Node2_Node5.41), Node2/Node6 (U0_Node2_Node6.41), Node2/Node7 (U0_Node2_Node7.41)
NetU0_Node3_Node1_34: Node3/Node1 (U0_Node3_Node1.34), Node3/Node2 (U0_Node3_Node2.34), Node3/Node3 (U0_Node3_Node3.34), Node3/Node4 (U0_Node3_Node4.34), Node3/Node5 (U0_Node3_Node5.34), Node3/Node6 (U0_Node3_Node6.34), Node3/Node7 (U0_Node3_Node7.34)
NetU0_Node3_Node1_36: Node3/Node1 (U0_Node3_Node1.36), Node3/Node2 (U0_Node3_Node2.36), Node3/Node3 (U0_Node3_Node3.36), Node3/Node4 (U0_Node3_Node4.36), Node3/Node5 (U0_Node3_Node5.36), Node3/Node6 (U0_Node3_Node6.36), Node3/Node7 (U0_Node3_Node7.36)
NetU0_Node3_Node1_41: Node3/Node1 (U0_Node3_Node1.41), Node3/Node2 (U0_Node3_Node2.41), Node3/Node3 (U0_Node3_Node3.41), Node3/Node4 (U0_Node3_Node4.41), Node3/Node5 (U0_Node3_Node5.41), Node3/Node6 (U0_Node3_Node6.41), Node3/Node7 (U0_Node3_Node7.41)
NetU0_Node4_Node1_34: Node4/Node1 (U0_Node4_Node1.34), Node4/Node2 (U0_Node4_Node2.34), Node4/Node3 (U0_Node4_Node3.34), Node4/Node4 (U0_Node4_Node4.34), Node4/Node5 (U0_Node4_Node5.34), Node4/Node6 (U0_Node4_Node6.34), Node4/Node7 (U0_Node4_Node7.34)
NetU0_Node4_Node1_36: Node4/Node1 (U0_Node4_Node1.36), Node4/Node2 (U0_Node4_Node2.36), Node4/Node3 (U0_Node4_Node3.36), Node4/Node4 (U0_Node4_Node4.36), Node4/Node5 (U0_Node4_Node5.36), Node4/Node6 (U0_Node4_Node6.36), Node4/Node7 (U0_Node4_Node7.36)
NetU0_Node4_Node1_41: Node4/Node1 (U0_Node4_Node1.41), Node4/Node2 (U0_Node4_Node2.41), Node4/Node3 (U0_Node4_Node3.41), Node4/Node4 (U0_Node4_Node4.41), Node4/Node5 (U0_Node4_Node5.41), Node4/Node6 (U0_Node4_Node6.41), Node4/Node7 (U0_Node4_Node7.41)
NetU0_Node5_Node1_34: Node5/Node1 (U0_Node5_Node1.34), Node5/Node2 (U0_Node5_Node2.34), Node5/Node3 (U0_Node5_Node3.34), Node5/Node4 (U0_Node5_Node4.34), Node5/Node5 (U0_Node5_Node5.34), Node5/Node6 (U0_Node5_Node6.34), Node5/Node7 (U0_Node5_Node7.34)
NetU0_Node5_Node1_36: Node5/Node1 (U0_Node5_Node1.36), Node5/Node2 (U0_Node5_Node2.36), Node5/Node3 (U0_Node5_Node3.36), Node5/Node4 (U0_Node5_Node4.36), Node5/Node5 (U0_Node5_Node5.36), Node5/Node6 (U0_Node5_Node6.36), Node5/Node7 (U0_Node5_Node7.36)
NetU0_Node5_Node1_41: Node5/Node1 (U0_Node5_Node1.41), Node5/Node2 (U0_Node5_Node2.41), Node5/Node3 (U0_Node5_Node3.41), Node5/Node4 (U0_Node5_Node4.41), Node5/Node5 (U0_Node5_Node5.41), Node5/Node6 (U0_Node5_Node6.41), Node5/Node7 (U0_Node5_Node7.41)
NetU0_Node6_Node1_34: Node6/Node1 (U0_Node6_Node1.34), Node6/Node2 (U0_Node6_Node2.34), Node6/Node3 (U0_Node6_Node3.34), Node6/Node4 (U0_Node6_Node4.34), Node6/Node5 (U0_Node6_Node5.34), Node6/Node6 (U0_Node6_Node6.34), Node6/Node7 (U0_Node6_Node7.34)
NetU0_Node6_Node1_36: Node6/Node1 (U0_Node6_Node1.36), Node6/Node2 (U0_Node6_Node2.36), Node6/Node3 (U0_Node6_Node3.36), Node6/Node4 (U0_Node6_Node4.36), Node6/Node5 (U0_Node6_Node5.36), Node6/Node6 (U0_Node6_Node6.36), Node6/Node7 (U0_Node6_Node7.36)
NetU0_Node6_Node1_41: Node6/Node1 (U0_Node6_Node1.41), Node6/Node2 (U0_Node6_Node2.41), Node6/Node3 (U0_Node6_Node3.41), Node6/Node4 (U0_Node6_Node4.41), Node6/Node5 (U0_Node6_Node5.41), Node6/Node6 (U0_Node6_Node6.41), Node6/Node7 (U0_Node6_Node7.41)
NetU0_Node7_Node1_34: Node7/Node1 (U0_Node7_Node1.34), Node7/Node2 (U0_Node7_Node2.34), Node7/Node3 (U0_Node7_Node3.34), Node7/Node4 (U0_Node7_Node4.34), Node7/Node5 (U0_Node7_Node5.34), Node7/Node6 (U0_Node7_Node6.34), Node7/Node7 (U0_Node7_Node7.34)
NetU0_Node7_Node1_36: Node7/Node1 (U0_Node7_Node1.36), Node7/Node2 (U0_Node7_Node2.36), Node7/Node3 (U0_Node7_Node3.36), Node7/Node4 (U0_Node7_Node4.36), Node7/Node5 (U0_Node7_Node5.36), Node7/Node6 (U0_Node7_Node6.36), Node7/Node7 (U0_Node7_Node7.36)
NetU0_Node7_Node1_41: Node7/Node1 (U0_Node7_Node1.41), Node7/Node2 (U0_Node7_Node2.41), Node7/Node3 (U0_Node7_Node3.41), Node7/Node4 (U0_Node7_Node4.41), Node7/Node5 (U0_Node7_Node5.41), Node7/Node6 (U0_Node7_Node6.41), Node7/Node7 (U0_Node7_Node7.41)
NetU0_Node8_Node1_34: Node8/Node1 (U0_Node8_Node1.34), Node8/Node2 (U0_Node8_Node2.34), Node8/Node3 (U0_Node8_Node3.34), Node8/Node4 (U0_Node8_Node4.34), Node8/Node5 (U0_Node8_Node5.34), Node8/Node6 (U0_Node8_Node6.34), Node8/Node7 (U0_Node8_Node7.34)
NetU0_Node8_Node1_36: Node8/Node1 (U0_Node8_Node1.36), Node8/Node2 (U0_Node8_Node2.36), Node8/Node3 (U0_Node8_Node3.36), Node8/Node4 (U0_Node8_Node4.36), Node8/Node5 (U0_Node8_Node5.36), Node8/Node6 (U0_Node8_Node6.36), Node8/Node7 (U0_Node8_Node7.36)
NetU0_Node8_Node1_41: Node8/Node1 (U0_Node8_Node1.41), Node8/Node2 (U0_Node8_Node2.41), Node8/Node3 (U0_Node8_Node3.41), Node8/Node4 (U0_Node8_Node4.41), Node8/Node5 (U0_Node8_Node5.41), Node8/Node6 (U0_Node8_Node6.41), Node8/Node7 (U0_Node8_Node7.41)
NetU0_Node9_Node1_34: Node9/Node1 (U0_Node9_Node1.34), Node9/Node2 (U0_Node9_Node2.34), Node9/Node3 (U0_Node9_Node3.34), Node9/Node4 (U0_Node9_Node4.34), Node9/Node5 (U0_Node9_Node5.34), Node9/Node6 (U0_Node9_Node6.34), Node9/Node7 (U0_Node9_Node7.34)
NetU0_Node9_Node1_36: Node9/Node1 (U0_Node9_Node1.36), Node9/Node2 (U0_Node9_Node2.36), Node9/Node3 (U0_Node9_Node3.36), Node9/Node4 (U0_Node9_Node4.36), Node9/Node5 (U0_Node9_Node5.36), Node9/Node6 (U0_Node9_Node6.36), Node9/Node7 (U0_Node9_Node7.36)
NetU0_Node9_Node1_41: Node9/Node1 (U0_Node9_Node1.41), Node9/Node2 (U0_Node9_Node2.41), Node9/Node3 (U0_Node9_Node3.41), Node9/Node4 (U0_Node9_Node4.41), Node9/Node5 (U0_Node9_Node5.41), Node9/Node6 (U0_Node9_Node6.41), Node9/Node7 (U0_Node9_Node7.41)
NetU0_Node10_Node1_34: Node10/Node1 (U0_Node10_Node1.34), Node10/Node2 (U0_Node10_Node2.34), Node10/Node3 (U0_Node10_Node3.34), Node10/Node4 (U0_Node10_Node4.34), Node10/Node5 (U0_Node10_Node5.34), Node10/Node6 (U0_Node10_Node6.34), Node10/Node7 (U0_Node10_Node7.34)
NetU0_Node10_Node1_36: Node10/Node1 (U0_Node10_Node1.36), Node10/Node2 (U0_Node10_Node2.36), Node10/Node3 (U0_Node10_Node3.36), Node10/Node4 (U0_Node10_Node4.36), Node10/Node5 (U0_Node10_Node5.36), Node10/Node6 (U0_Node10_Node6.36), Node10/Node7 (U0_Node10_Node7.36)
NetU0_Node10_Node1_41: Node10/Node1 (U0_Node10_Node1.41), Node10/Node2 (U0_Node10_Node2.41), Node10/Node3 (U0_Node10_Node3.41), Node10/Node4 (U0_Node10_Node4.41), Node10/Node5 (U0_Node10_Node5.41), Node10/Node6 (U0_Node10_Node6.41), Node10/Node7 (U0_Node10_Node7.41)
NetU0_Node11_Node1_34: Node11/Node1 (U0_Node11_Node1.34), Node11/Node2 (U0_Node11_Node2.34), Node11/Node3 (U0_Node11_Node3.34), Node11/Node4 (U0_Node11_Node4.34), Node11/Node5 (U0_Node11_Node5.34), Node11/Node6 (U0_Node11_Node6.34), Node11/Node7 (U0_Node11_Node7.34)
NetU0_Node11_Node1_36: Node11/Node1 (U0_Node11_Node1.36), Node11/Node2 (U0_Node11_Node2.36), Node11/Node3 (U0_Node11_Node3.36), Node11/Node4 (U0_Node11_Node4.36), Node11/Node5 (U0_Node11_Node5.36), Node11/Node6 (U0_Node11_Node6.36), Node11/Node7 (U0_Node11_Node7.36)
NetU0_Node11_Node1_41: Node11/Node1 (U0_Node11_Node1.41), Node11/Node2 (U0_Node11_Node2.41), Node11/Node3 (U0_Node11_Node3.41), Node11/Node4 (U0_Node11_Node4.41), Node11/Node5 (U0_Node11_Node5.41), Node11/Node6 (U0_Node11_Node6.41), Node11/Node7 (U0_Node11_Node7.41)
NetU0_Node12_Node1_34: Node12/Node1 (U0_Node12_Node1.34), Node12/Node2 (U0_Node12_Node2.34), Node12/Node3 (U0_Node12_Node3.34), Node12/Node4 (U0_Node12_Node4.34), Node12/Node5 (U0_Node12_Node5.34), Node12/Node6 (U0_Node12_Node6.34), Node12/Node7 (U0_Node12_Node7.34)
NetU0_Node12_Node1_36: Node12/Node1 (U0_Node12_Node1.36), Node12/Node2 (U0_Node12_Node2.36), Node12/Node3 (U0_Node12_Node3.36), Node12/Node4 (U0_Node12_Node4.36), Node12/Node5 (U0_Node12_Node5.36), Node12/Node6 (U0_Node12_Node6.36), Node12/Node7 (U0_Node12_Node7.36)
NetU0_Node12_Node1_41: Node12/Node1 (U0_Node12_Node1.41), Node12/Node2 (U0_Node12_Node2.41), Node12/Node3 (U0_Node12_Node3.41), Node12/Node4 (U0_Node12_Node4.41), Node12/Node5 (U0_Node12_Node5.41), Node12/Node6 (U0_Node12_Node6.41), Node12/Node7 (U0_Node12_Node7.41)
NetU0_Node13_Node1_34: Node13/Node1 (U0_Node13_Node1.34), Node13/Node2 (U0_Node13_Node2.34), Node13/Node3 (U0_Node13_Node3.34), Node13/Node4 (U0_Node13_Node4.34), Node13/Node5 (U0_Node13_Node5.34), Node13/Node6 (U0_Node13_Node6.34), Node13/Node7 (U0_Node13_Node7.34)
NetU0_Node13_Node1_36: Node13/Node1 (U0_Node13_Node1.36), Node13/Node2 (U0_Node13_Node2.36), Node13/Node3 (U0_Node13_Node3.36), Node13/Node4 (U0_Node13_Node4.36), Node13/Node5 (U0_Node13_Node5.36), Node13/Node6 (U0_Node13_Node6.36), Node13/Node7 (U0_Node13_Node7.36)
NetU0_Node13_Node1_41: Node13/Node1 (U0_Node13_Node1.41), Node13/Node2 (U0_Node13_Node2.41), Node13/Node3 (U0_Node13_Node3.41), Node13/Node4 (U0_Node13_Node4.41), Node13/Node5 (U0_Node13_Node5.41), Node13/Node6 (U0_Node13_Node6.41), Node13/Node7 (U0_Node13_Node7.41)